# EAGLE design ring counter (EAGLE 9.6.1)
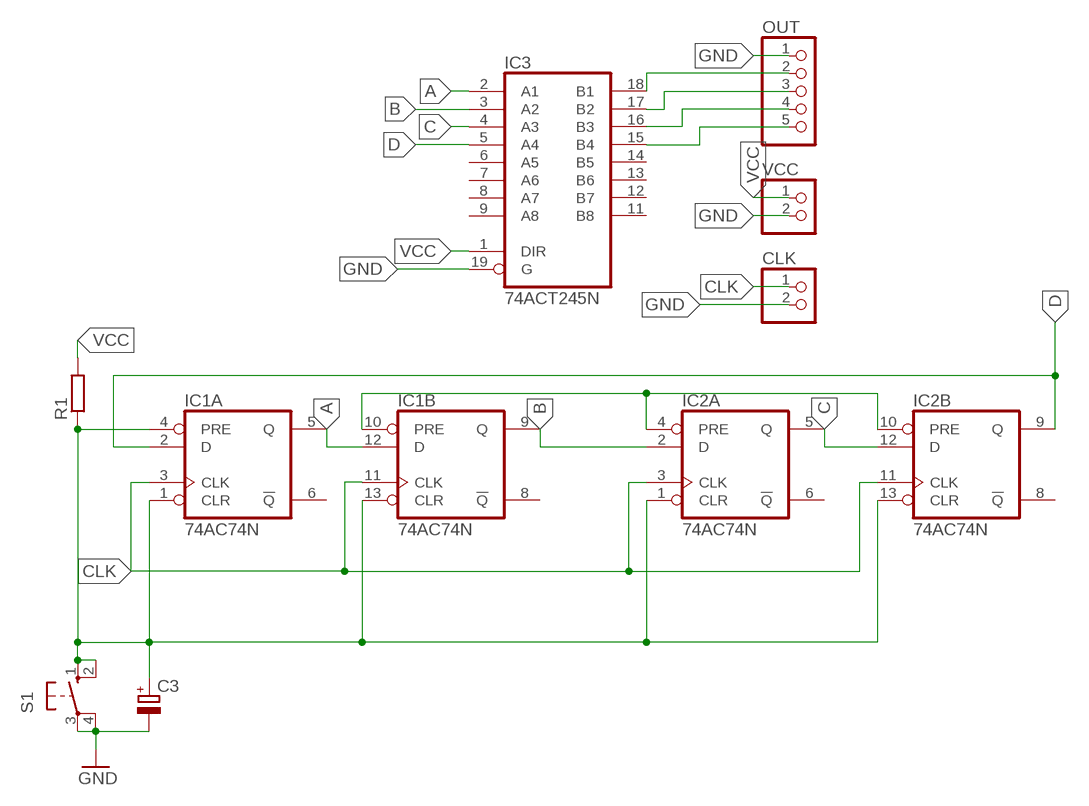
[diagram p0: schematic, sheet 1]

## Parts
C3  CPOL-EUE2,5-6E  [E2,5-6E]
CLK  PINHD-1X2  [1X02]
IC1  74AC74N  [DIL14]
IC2  74AC74N  [DIL14]
IC3  74ACT245N  [DIL20]
OUT  PINHD-1X5  [1X05]
R1  R-EU_0207/12  [0207/12]
S1  10-XX  [B3F-10XX]
VCC  PINHD-1X2  [1X02]

## Nets
A: IC1.5(A:Q) IC1.12(B:D) IC3.2(A1)
B: IC1.9(B:Q) IC2.2(A:D) IC3.3(A2)
C: IC2.5(A:Q) IC2.12(B:D) IC3.4(A3)
CLK: CLK.1 IC1.3(A:CLK) IC1.11(B:CLK) IC2.3(A:CLK) IC2.11(B:CLK)
D: IC1.2(A:D) IC2.9(B:Q) IC3.5(A4)
GND: C3.- CLK.2 IC3.19(G) OUT.1 S1.3(P) S1.4(P1) VCC.2
N$1: IC1.10(B:PRE) IC2.4(A:PRE) IC2.10(B:PRE)
N$2: C3.+ IC1.1(A:CLR) IC1.4(A:PRE) IC1.13(B:CLR) IC2.1(A:CLR) IC2.13(B:CLR) R1.1 S1.1(S) S1.2(S1)
N$3: IC3.18(B1) OUT.2
N$4: IC3.17(B2) OUT.3
N$5: IC3.16(B3) OUT.4
N$6: IC3.15(B4) OUT.5
VCC: IC3.1(DIR) R1.2 VCC.1
Unconnected: IC1.6(A:!Q) IC1.8(B:!Q) IC2.6(A:!Q) IC2.8(B:!Q) IC3.6(A5) IC3.7(A6) IC3.8(A7) IC3.9(A8) IC3.11(B8) IC3.12(B7) IC3.13(B6) IC3.14(B5)

## Power pins joined to a net without a drawn wire
GND: IC1.7(P:GND) IC2.7(P:GND) IC3.10(GND)
VCC: IC1.14(P:VCC) IC2.14(P:VCC) IC3.20(VCC)

## Library data of the parts
C3 = rcl:CPOL-EU: POLARIZED CAPACITOR, European symbol; SPICEPREFIX: C
CLK VCC = pinhead 2:PINHD-1X2: PIN HEADER
IC1 IC2 = 74xx-eu EDIT:74*74: Dual D type positive edge triggered FLIP FLOP, preset and clear
IC3 = 74xx-eu EDIT:74*245: Octal BUS TRANSCEIVER, 3-state
OUT = pinhead 2:PINHD-1X5: PIN HEADER
R1 = rcl:R-EU_: RESISTOR, European symbol; SPICEPREFIX: R
S1 = switch-omron:10-XX: OMRON SWITCH; MPN: B3F-1000; OC_FARNELL: 176432; OC_NEWARK: 36M3542

## Board
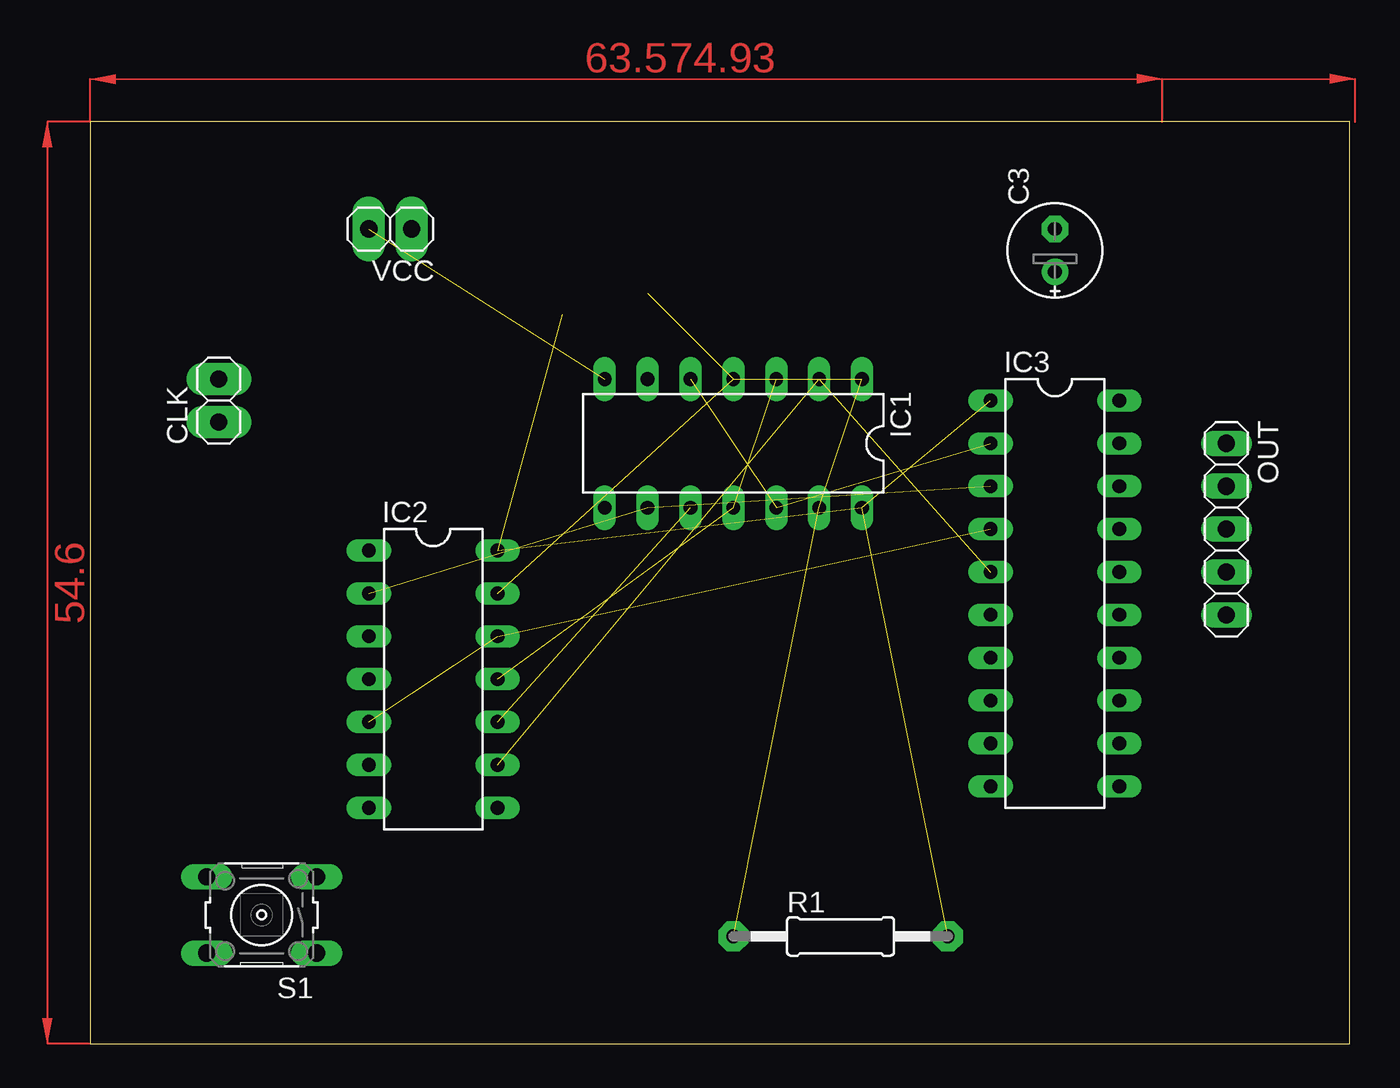
[diagram p1: board, top side]
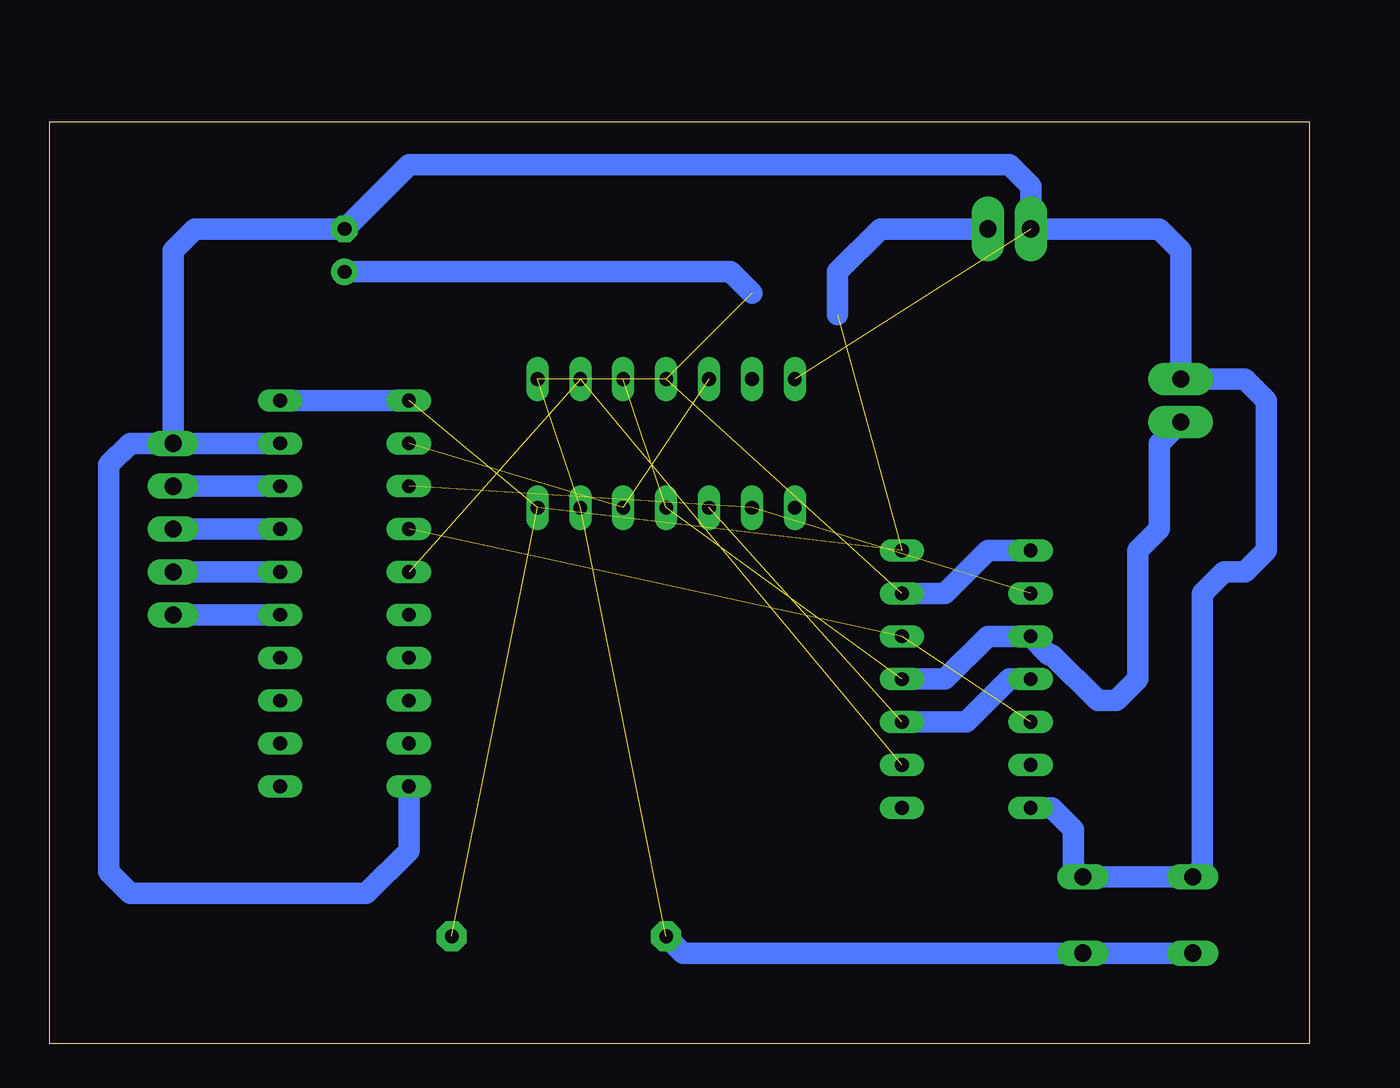
[diagram p2: board, bottom side, seen from below]

Size 74.6 x 54.6 mm. Coordinates in mm from the lower left corner, seen from the top.
Outline: 0,0 74.6,0 74.6,54.6 0,54.6 0,0
Copper layers (1*16): Top 0.035mm / dielectric 1.5mm / Bottom 0.035mm
Design rules "default": minimum track width 6mil, minimum drill 0.35mm, track to track 6mil, track to pad 6mil, pad to pad 6mil, via to via 6mil, smd to smd 6mil, copper to edge 40mil, drill to drill 6mil, minimum pad ring 10mil, minimum via ring 8mil, stop-mask expansion 4mil, vias tented up to drill 0mil, thermal gap 10mil

### Footprints (pad centres in the part's own frame; a part is rotated, then mirrored left to right if it is on the bottom)
E2,5-6E = drill 0.813 pad 1.575: + -1.27,0 | drill 0.813 pad 1.575 octagon: - 1.27,0
1X02 = drill 1.016 pad 1.93 long: 1 -1.27,0; 2 1.27,0
DIL14 = drill 0.813 long: 1 -7.62,-3.81; 2 -5.08,-3.81; 3 -2.54,-3.81; 4 0,-3.81; 5 2.54,-3.81; 6 5.08,-3.81; 7 7.62,-3.81; 8 7.62,3.81; 9 5.08,3.81; 10 2.54,3.81; 11 0,3.81; 12 -2.54,3.81; 13 -5.08,3.81; 14 -7.62,3.81
DIL20 = drill 0.813 long: 1 -11.43,-3.81; 2 -8.89,-3.81; 3 -6.35,-3.81; 4 -3.81,-3.81; 5 -1.27,-3.81; 6 1.27,-3.81; 7 3.81,-3.81; 8 6.35,-3.81; 9 8.89,-3.81; 10 11.43,-3.81; 11 11.43,3.81; 12 8.89,3.81; 13 6.35,3.81; 14 3.81,3.81; 15 1.27,3.81; 16 -1.27,3.81; 17 -3.81,3.81; 18 -6.35,3.81; 19 -8.89,3.81; 20 -11.43,3.81
1X05 = drill 1.016 long: 1 -5.08,0; 2 -2.54,0; 3 0,0; 4 2.54,0; 5 5.08,0
0207/12 = drill 0.813 pad 1.778 octagon: 1 -6.35,0; 2 6.35,0
B3F-10XX = drill 1.016 long: 1 -3.251,2.261; 2 3.251,2.261; 3 -3.251,-2.261; 4 3.251,-2.261

### Placement (x,y rotation side)
C3  57.15,46.99 90 top
CLK  7.62,38.1 90 top
IC1  38.1,35.56 180 top
IC2  20.32,21.59 270 top
IC3  57.15,26.67 270 top
OUT  67.31,30.48 270 top
R1  44.45,6.35 0 top
S1  10.16,7.62 180 top
VCC  17.78,48.26 180 top

### Tracks (layer width: path | path; a pad name or v marks a point on that pad's centre or on a via)
A  (2 unrouted)
B  (2 unrouted)
C  (2 unrouted)
CLK  (2 unrouted)
  Bottom 1.27: CLK.1 8.89,35.56 8.89,30.48 10.16,29.21 10.16,21.59 11.43,20.32 12.53,20.32 15.25,23.04 15.42,23.04 IC2.3 19.05,24.13 21.59,21.59 IC2.11
D  (2 unrouted)
GND  (1 unrouted)
  Bottom 1.27: IC3.10 53.34,11.43 55.88,8.89 69.85,8.89 71.12,10.16 71.12,34.29 69.85,35.56 OUT.1 | IC3.19 OUT.1 | OUT.1 67.31,46.99 66.04,48.26 C3.- 53.34,52.07 17.78,52.07 16.51,50.8 VCC.2 8.89,48.26 7.62,46.99 CLK.2 3.81,39.37 2.54,38.1 2.54,29.21 3.81,27.94 5.08,27.94 6.35,26.67 6.35,10.44 S1.4 S1.3 13.97,10.44 13.97,12.7 15.24,13.97 IC2.7
N$1  (1 unrouted)
  Bottom 1.27: IC2.4 17.78,21.59 20.32,19.05 IC2.10
N$2  (5 unrouted)
  Bottom 1.27: R1.1 37.11,5.36 S1.1 S1.2 | IC2.1 19.05,29.21 21.59,26.67 IC2.13 | C3.+ 34.29,45.72 33.02,44.45
N$3
  Bottom 1.27: IC3.18 OUT.2
N$4
  Bottom 1.27: IC3.17 OUT.3
N$5
  Bottom 1.27: IC3.16 OUT.4
N$6
  Bottom 1.27: IC3.15 OUT.5
VCC  (4 unrouted)
  Bottom 1.27: VCC.1 25.4,48.26 27.94,45.72 27.94,43.18 | IC3.20 IC3.1
(copper drawn outside any net)
  shapes: Top area x3